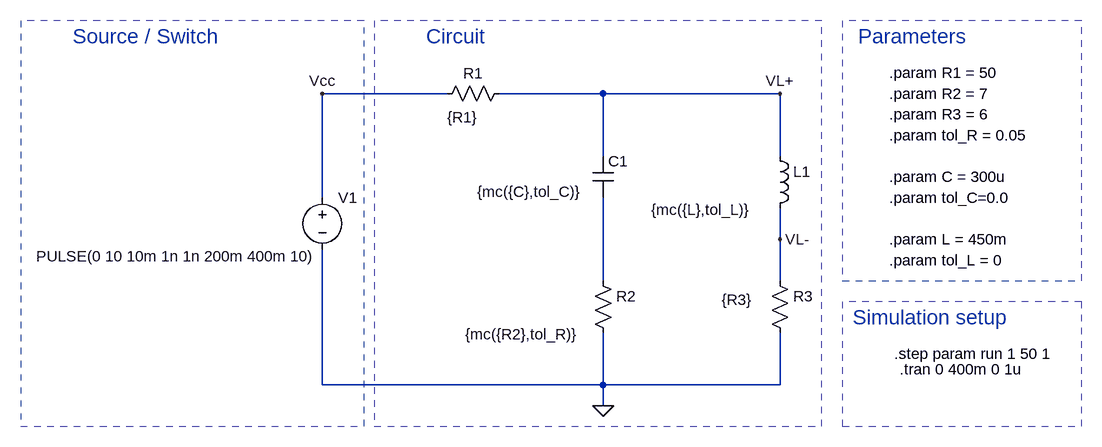
[diagram p0: schematic Simulacion SPICE - Montecarlo R2.asc]
Simulacion SPICE - Montecarlo R2.asc, the LTspice schematic file:
Version 4
SHEET 1 880 680
WIRE -368 -176 -560 -176
WIRE -128 -176 -288 -176
WIRE 144 -176 -128 -176
WIRE -128 -80 -128 -176
WIRE 144 -80 144 -176
WIRE -560 -16 -560 -176
WIRE 144 48 144 0
WIRE -128 112 -128 -16
WIRE 144 112 144 48
WIRE -560 272 -560 64
WIRE -128 272 -128 192
WIRE -128 272 -560 272
WIRE 144 272 144 192
WIRE 144 272 -128 272
WIRE -128 304 -128 272
FLAG -128 304 0
FLAG -560 -176 Vcc
FLAG 144 -176 VL+
FLAG 144 48 VL-
SYMBOL res -272 -192 R90
WINDOW 0 0 56 VBottom 2
WINDOW 3 37 72 VTop 2
SYMATTR InstName R1
SYMATTR Value {R1}
SYMBOL cap -144 -80 R0
WINDOW 3 -178 55 Left 2
SYMATTR Value {mc({C},tol_C)}
SYMATTR InstName C1
SYMBOL res -144 96 R0
WINDOW 3 -196 98 Left 2
SYMATTR Value {mc({R2},tol_R)}
SYMATTR InstName R2
SYMBOL res 128 96 R0
WINDOW 3 -74 45 Left 2
SYMATTR Value {R3}
SYMATTR InstName R3
SYMBOL ind 128 -96 R0
WINDOW 3 -182 99 Left 2
SYMATTR Value {mc({L},tol_L)}
SYMATTR InstName L1
SYMBOL voltage -560 -32 R0
WINDOW 3 -440 106 Left 2
WINDOW 123 0 0 Left 0
WINDOW 39 0 0 Left 0
SYMATTR Value PULSE(0 10 10m 1n 1n 200m 400m 10)
SYMATTR InstName V1
TEXT -400 -264 Left 3 ;Circuit
TEXT -944 -264 Left 3 ;Source / Switch
TEXT 264 -264 Left 3 ;Parameters
TEXT 312 -208 Left 2 !.param R1 = 50
TEXT 312 -176 Left 2 !.param R2 = 7
TEXT 312 -144 Left 2 !.param R3 = 6
TEXT 312 -48 Left 2 !.param C = 300u
TEXT 312 48 Left 2 !.param L = 450m
TEXT 256 168 Left 3 ;Simulation setup
TEXT 312 -112 Left 2 !.param tol_R = 0.05
TEXT 312 -16 Left 2 !.param tol_C=0.0
TEXT 312 80 Left 2 !.param tol_L = 0
TEXT 320 224 Left 2 !.step param run 1 50 1
TEXT 328 248 Left 2 !.tran 0 400m 0 1u
RECTANGLE Normal -496 -288 -1024 336 2
RECTANGLE Normal 208 -288 -480 336 2
RECTANGLE Normal 608 144 240 336 2
RECTANGLE Normal 608 -288 240 112 2

The netlist it stands for:
* Simulacion SPICE - Montecarlo R2.asc
R1 VL+ Vcc {R1}
C1 VL+ N001 {mc({C},tol_C)}
R2 N001 0 {mc({R2},tol_R)}
R3 VL- 0 {R3}
L1 VL+ VL- {mc({L},tol_L)}
V1 Vcc 0 PULSE(0 10 10m 1n 1n 200m 400m 10)
* Circuit
* Source / Switch
* Parameters
.param R1 = 50
.param R2 = 7
.param R3 = 6
.param C = 300u
.param L = 450m
* Simulation setup
.param tol_R = 0.05
.param tol_C=0.0
.param tol_L = 0
.step param run 1 50 1
.tran 0 400m 0 1u
.backanno
.end

* Results of the author's LTspice run, read from the files saved beside the schematic
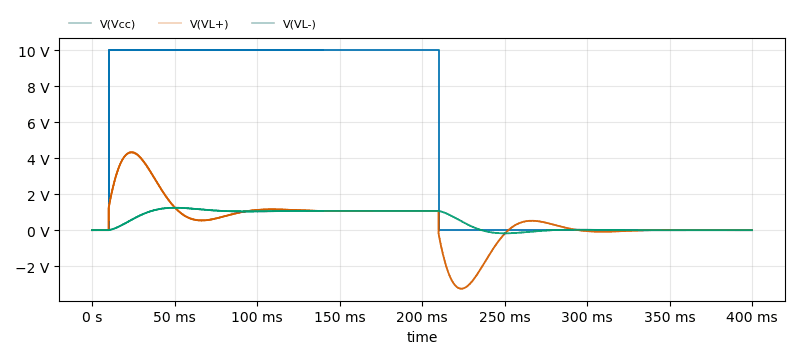
[diagram p1: Transient Analysis of Simulacion SPICE - Montecarlo R2.asc, plotted from the saved traces]
* Transient Analysis, 4 runs:
*   V(Vcc) [run 1]: min 0 V, max 10 V, average 5 V, rms 7.071 V, last 0 V
*   V(Vcc) [run 2]: min 0 V, max 10 V, average 5 V, rms 7.071 V, last 0 V
*   V(Vcc) [run 3]: min 0 V, max 10 V, average 5 V, rms 7.071 V, last 0 V
*   V(Vcc) [run 4]: min 0 V, max 10 V, average 9.287 V, rms 9.637 V, last 10 V
*   V(VL+) [run 1]: min -3.259 V, max 4.329 V, average 535.8 mV, rms 1.412 V, last -2.014 mV
*   V(VL+) [run 2]: min -3.259 V, max 4.328 V, average 535.8 mV, rms 1.411 V, last -2.011 mV
*   V(VL+) [run 3]: min -3.247 V, max 4.318 V, average 535.8 mV, rms 1.409 V, last -1.967 mV
*   V(VL+) [run 4]: min 0 V, max 4.344 V, average 1.497 V, rms 1.908 V, last 1.065 V
*   V(VL-) [run 1]: min -176.8 mV, max 1.248 V, average 535.7 mV, rms 758.2 mV, last 154.6 µV
*   V(VL-) [run 2]: min -176.7 mV, max 1.248 V, average 535.7 mV, rms 758.2 mV, last 155.3 µV
*   V(VL-) [run 3]: min -175.3 mV, max 1.247 V, average 535.7 mV, rms 758.1 mV, last 164.9 µV
*   V(VL-) [run 4]: min 0 V, max 1.25 V, average 921 mV, rms 994.1 mV, last 1.076 V